# Altium project PIR Sensor driver v4.PrjPcb
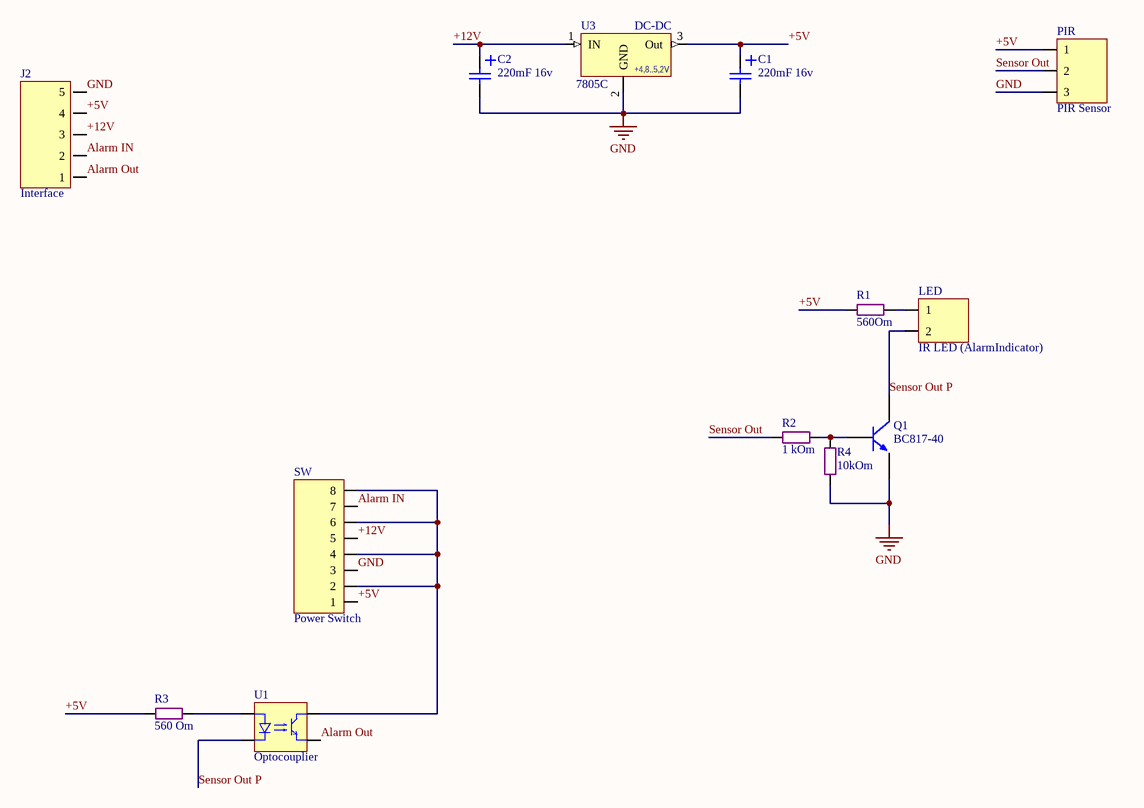
[diagram p0: PIR Sensor driver v4.SchDoc]
1 sheet, 13 parts. Net scope: global (net labels, ports and power ports of the same name join across sheets).
Board file: PIR Sensor driver v4.PcbDoc

## Sheet PIR Sensor driver v4.SchDoc: PIR Universal Interface Board
size A4; Version: 4.0; Variant: Driver for PIR 501 Sensor; Modification: Mod; Project: Sensors; PageSetup: Record=PageOptions|CenterHorizontal=True|CenterVertical=True|PrintScale=0.97|XCorrection=1.00|YCorrection=1.00|PrintKind=1|BorderSize=5000000|LeftOffset=0|BottomOffset=0|Orientation=2|PaperLength=2970|PaperWidth=2100|Scale=100|PaperSource=7|PrintQuality=-4|MediaType=1|DitherType=10|PaperKind=A4|PrintScaleMode=1

### Parts
C1  220mF 16v  [Cap E p4mm D6.5xH11]
C2  220mF 16v  [Cap E p2mm D6.5xH11]
J2  Interface  [Line 2.54 x 5 - (D2mm)]
LED  IR LED (AlarmIndicator)  [Line 2.54 x 2]
PIR  PIR Sensor  [Line 2.54 X 3]
Q1  BC817-40  [SOT-23]
R1  560Om  [SMD 0805 (2012) Long]
R2  1 kOm  [SMD 0805 (2012)]
R3  560 Om  [SMD 0805 (2012)]
R4  10kOm  [SMD 0805 (2012)]
SW  Power Switch  [Line 2.54 X 8D (2 x 4)]
U1  Optocouplier  [DIP-4]
U3  7805C  V Out: +4,8..5,2V  [D-PAK]

### Nets
GND: C1.2 C2.2 J2.5 PIR.3 Q1.2(E) R4.1 SW.3 U3.2(GND)
+5V: C1.1 J2.4 PIR.1 R1.1 R3.1 SW.1 U3.3(Out)
+12V: C2.1 J2.3 SW.5 U3.1(IN)
Alarm IN: J2.2 SW.7
Alarm Out: J2.1 U1.4
Sensor Out: PIR.2 R2.1
Sensor Out P: LED.2 Q1.3(C) U1.2
NetLED_1: LED.1 R1.2
NetQ1_1: Q1.1(B) R2.2 R4.2
NetR3_2: R3.2 U1.1
NetSW_2: SW.2 SW.4 SW.6 SW.8 U1.3

### Notes on the sheet
- (near U3) DC-DC
- Ver:
- Rev:
- Sheet
- of
- File:

### Library data of the parts
C1 C2 = Cap E 220mF x 16V: Capacitor; Value: 220mF 16v
J2 = PLS-5: Vert, Sgl line, Male
LED = PLS-2: Vert, Sgl line, Male
PIR = PLS-3: Vert, Sgl line, Male
Q1 = BC817-40: NPN 45 V, 500 mA NPN general-purpose transistor; type: 45 V, 500 mA NPN general-purpose transistors; Name: BC817-40; url: http://lib.chipdip.ru/156/DOC000156781.pdf
R1 R4 = Res All Types
R2 R3 = Res SMD 0805
SW = PLD-8 (2 x 4): Vert, Sgl line, Male
U1 = Optocouplier LTV 817B: LTV817 Datasheet: http://lib.chipdip.ru/222/DOC000222300.pdf; Name: LTV817B
U3 = 7805C: Voltage Regulator; Manufacturer: Интеграл; I output (A): 1; Max Voltage In (V): 35; Напряжение выход-вход (dropout): >2V; t: -10..+70°C; Case: D2PAK; Shema: http://tec.org.ru/_bd/5/57349922.jpg; Name: 7805C